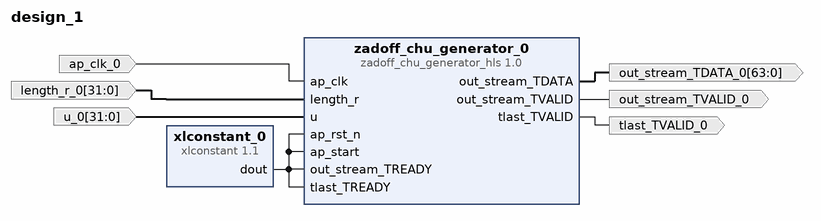
[diagram p0: block diagram of the top level]
# Vivado block design design_1, xczu7ev-ffvc1156-2-e, Vivado 2022.2
create_bd_design design_1

create_bd_port -dir I -type clk ap_clk_0
create_bd_port -dir O out_stream_TVALID_0
create_bd_port -dir O -from 63 -to 0 out_stream_TDATA_0
create_bd_port -dir I -from 31 -to 0 -type data length_r_0
create_bd_port -dir I -from 31 -to 0 -type data u_0
create_bd_port -dir O tlast_TVALID_0

create_bd_cell -type ip -vlnv xilinx.com:ip:xlconstant:1.1 xlconstant_0
create_bd_cell -type ip -vlnv xilinx.com:hls:zadoff_chu_generator_hls:1.0 zadoff_chu_generator_0

# ---- connections ----

connect_bd_net -net ap_clk_0_1 [get_bd_ports ap_clk_0] [get_bd_pins zadoff_chu_generator_0/ap_clk]
connect_bd_net -net length_r_0_1 [get_bd_ports length_r_0] [get_bd_pins zadoff_chu_generator_0/length_r]
connect_bd_net -net u_0_1 [get_bd_ports u_0] [get_bd_pins zadoff_chu_generator_0/u]
connect_bd_net [get_bd_pins xlconstant_0/dout] \
  [get_bd_pins zadoff_chu_generator_0/ap_rst_n] [get_bd_pins zadoff_chu_generator_0/ap_start] \
  [get_bd_pins zadoff_chu_generator_0/out_stream_TREADY] [get_bd_pins zadoff_chu_generator_0/tlast_TREADY]
connect_bd_net [get_bd_pins zadoff_chu_generator_0/out_stream_TDATA] [get_bd_ports out_stream_TDATA_0]
connect_bd_net [get_bd_pins zadoff_chu_generator_0/out_stream_TVALID] [get_bd_ports out_stream_TVALID_0]
connect_bd_net [get_bd_pins zadoff_chu_generator_0/tlast_TVALID] [get_bd_ports tlast_TVALID_0]

validate_bd_design
save_bd_design
